# EAGLE design 3xLED_Panel (EAGLE 9.6.2)
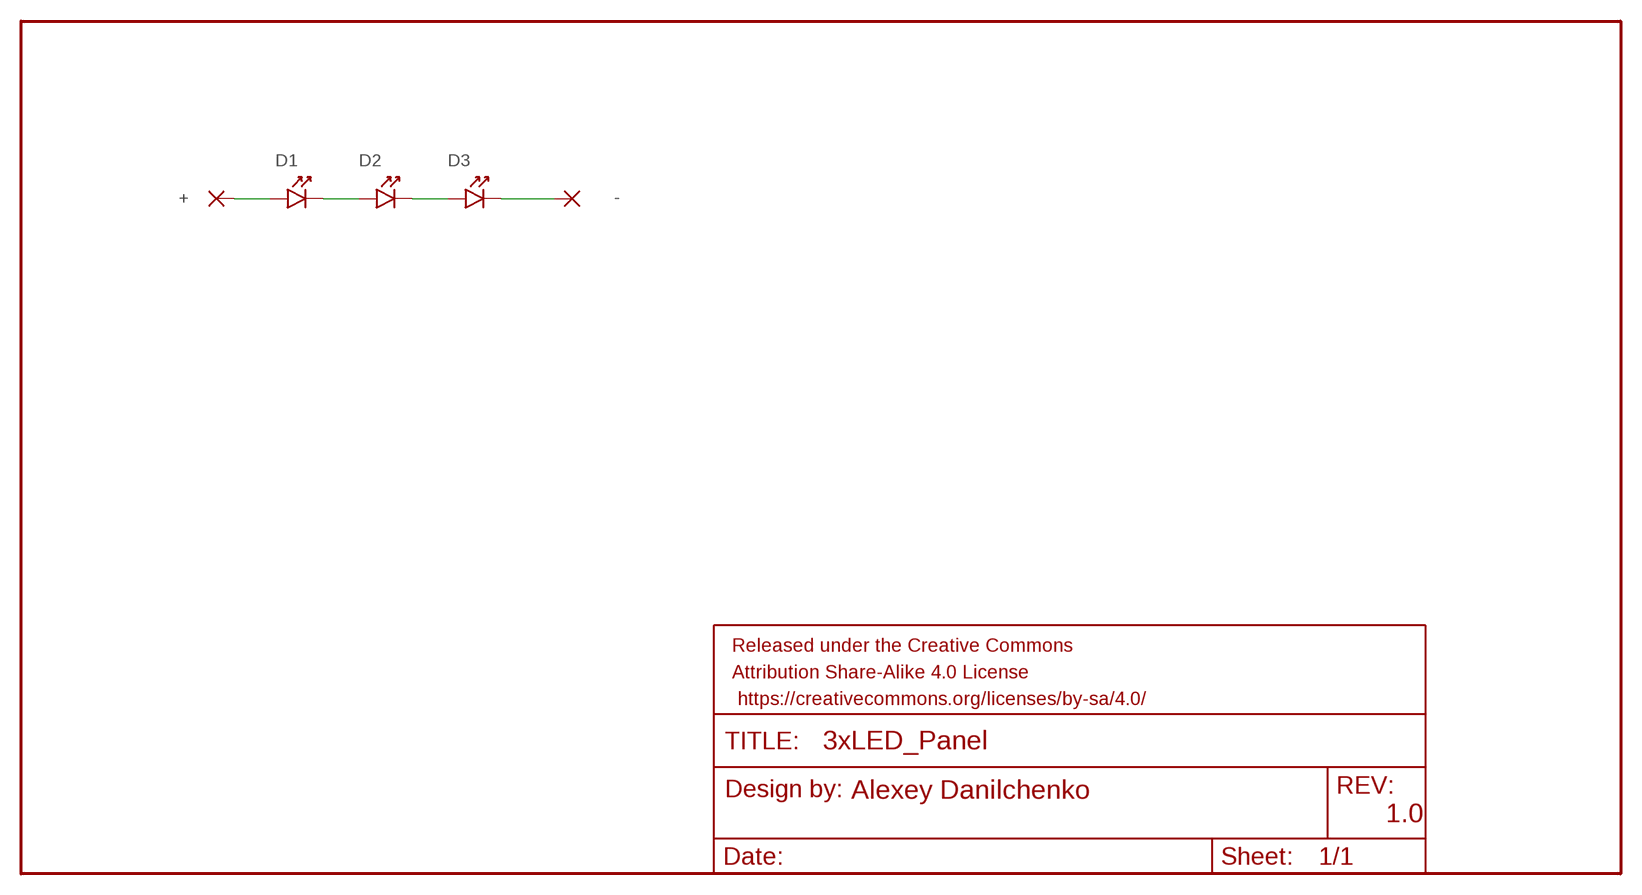
[diagram p0: schematic, sheet 1]

## Parts
+  WIREPAD1,6/0,9  SMD3X2.15  [SMD3-2,15]
-  SMD3X2.15  [SMD3-2,15]
D1  YUJI_2835_SMD  [2835_SMD]
D2  YUJI_2835_SMD  [2835_SMD]
D3  YUJI_2835_SMD  [2835_SMD]
FRAME1  FRAME-LEDGER  [CREATIVE_COMMONS]

## Nets
N$1: D1.CATHODE D2.ANODE
N$2: +.1(P) D1.ANODE
N$3: D2.CATHODE D3.ANODE
N$4: -.1(P) D3.CATHODE

## Library data of the parts
+ - = wirepad:SMD3X2.15: SMD PAD
D1-D3 = Yuji_LED:YUJI_2835_SMD
FRAME1 = SparkFun-Aesthetics:FRAME-LEDGER: Schematic Frame Standard 11x14 US Ledger frame; AUTHOR: Alexey Danilchenko; VER: 1.0

## Board
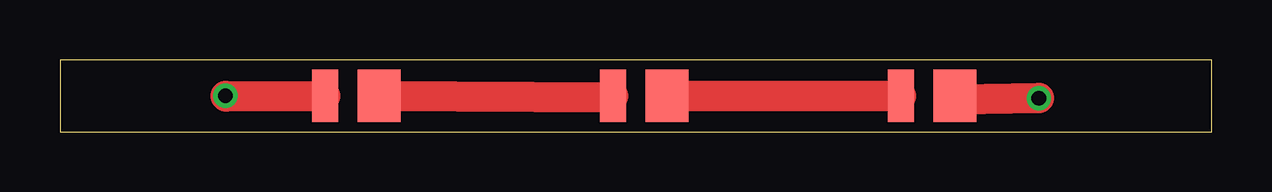
[diagram p1: board, top side]
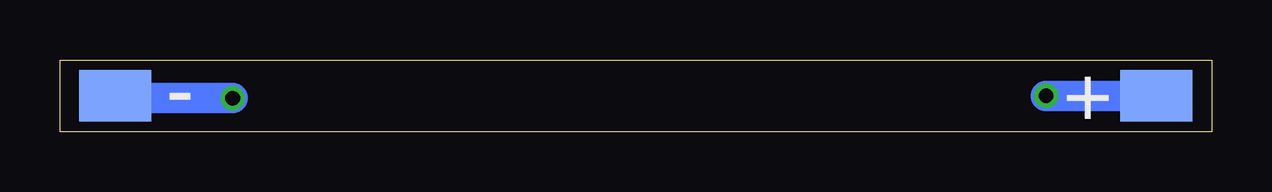
[diagram p2: board, bottom side, seen from below]

Size 48 x 3 mm. Coordinates in mm from the lower left corner, seen from the top.
Outline: 0,0 48,0 48,3 0,3 0,0
Copper layers (1*16): Top 0.035mm / dielectric 1.5mm / Bottom 0.035mm
Design rules "default": minimum track width 10mil, minimum drill 24mil, track to track 8mil, track to pad 8mil, pad to pad 8mil, via to via 8mil, smd to smd 8mil, copper to edge 40mil, drill to drill 8mil, minimum pad ring 10mil, minimum via ring 8mil, stop-mask expansion 4mil, vias tented up to drill 0mil, thermal gap 10mil

### Footprints (pad centres in the part's own frame; a part is rotated, then mirrored left to right if it is on the bottom)
SMD3-2,15 = smd 3 x 2.15: 1 0,0
2835_SMD = smd 1.1 x 2.2: ANODE 0.95,0 | smd 1.8 x 2.2: CATHODE -1.3,0

### Placement (x,y rotation side)
+  2.3,1.5 0 bottom
-  45.7,1.5 0 bottom
D1  12,1.5 180 top
D2  24,1.5 180 top
D3  36,1.5 180 top
FRAME1  0,0 0 top

### Tracks (layer width: path | path; a pad name or v marks a point on that pad's centre or on a via)
N$1
  Top 1.27: D1.CATHODE 23,1.43 D2.ANODE
N$2  (via drill 0.61)
  Top 1.27: v6.9,1.5 6.92,1.48 D1.ANODE
  Bottom 1.27: v6.9,1.5 +.1
N$3
  Top 1.27: D3.ANODE D2.CATHODE
N$4  (via drill 0.61)
  Top 1.27: v40.8,1.4 37.44,1.35 D3.CATHODE
  Bottom 1.27: v40.8,1.4 45.9,1.4 -.1

### Text on the board
bNames: + | -